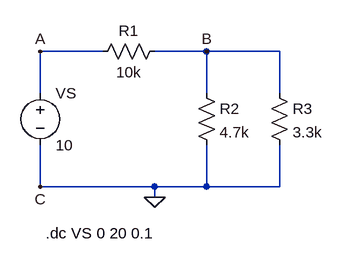
[diagram p0: schematic dc_sweep.asc]
dc_sweep.asc, the LTspice schematic file:
Version 4.1
SHEET 1 880 680
WIRE 96 64 0 64
WIRE 256 64 176 64
WIRE 368 64 256 64
WIRE 0 128 0 64
WIRE 256 128 256 64
WIRE 368 128 368 64
WIRE 0 272 0 208
WIRE 176 272 0 272
WIRE 256 272 256 208
WIRE 256 272 176 272
WIRE 368 272 368 208
WIRE 368 272 256 272
WIRE 176 288 176 272
FLAG 176 288 0
FLAG 256 64 B
FLAG 0 64 A
FLAG 0 272 C
SYMBOL res 80 80 R270
WINDOW 0 32 56 VTop 2
WINDOW 3 0 56 VBottom 2
SYMATTR InstName R1
SYMATTR Value 10k
SYMBOL res 240 112 R0
SYMATTR InstName R2
SYMATTR Value 4.7k
SYMBOL res 352 112 R0
SYMATTR InstName R3
SYMATTR Value 3.3k
SYMBOL voltage 0 112 R0
SYMATTR InstName VS
SYMATTR Value 10
TEXT 8 344 Left 2 !.dc VS 0 20 0.1

The netlist it stands for:
* dc_sweep.asc
R1 A B 10k
R2 B 0 4.7k
R3 B 0 3.3k
VS A 0 10
.dc VS 0 20 0.1
.backanno
.end